# Altium schematic sheet currentW_cond.SchDoc
size A4; SheetNumber: 4; SheetTotal: 12; SPICEModelCacheJNOYGZHY: <root> / <DocumentId>JNOYGZHY</DocumentId> / </root>
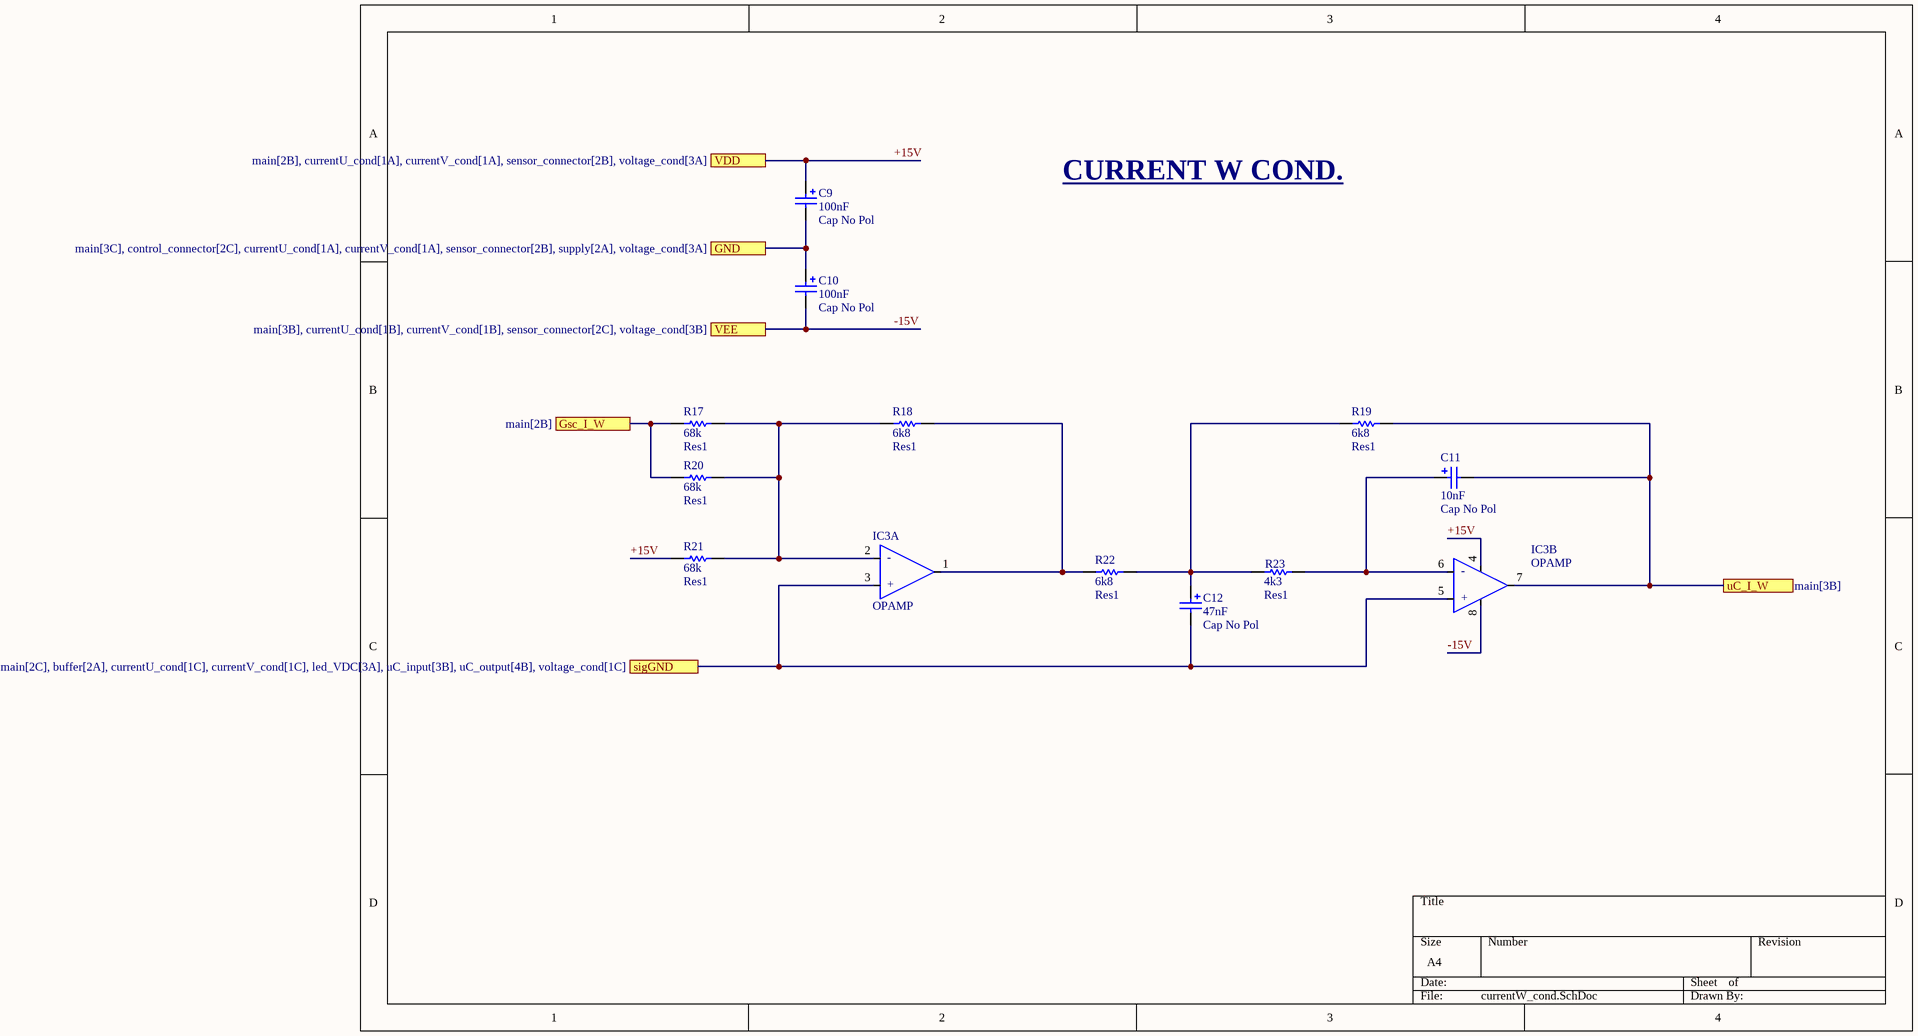
[diagram p0: currentW_cond.SchDoc]

## Parts
C9  Cap No Pol  value 100nF  [RAD-0.1_mod]
C10  Cap No Pol  value 100nF  [RAD-0.1_mod]
C11  Cap No Pol  value 10nF  [RAD-0.1_mod]
C12  Cap No Pol  value 47nF  [RAD-0.1_mod]
IC3  OPAMP  [DIP-8_mod]  (parts A,B of 2)
R17  Res1  value 68k  [AXIAL-0.3_mod]
R18  Res1  value 6k8  [AXIAL-0.3_mod]
R19  Res1  value 6k8  [AXIAL-0.3_mod]
R20  Res1  value 68k  [AXIAL-0.3_mod]
R21  Res1  value 68k  [AXIAL-0.3_mod]
R22  Res1  value 6k8  [AXIAL-0.3_mod]
R23  Res1  value 4k3  [AXIAL-0.3_mod]

## Ports
GND (see main[3C], control_connector[2C], currentU_cond[1A], currentV_cond[1A], sensor_connector[2B], supply[2A], voltage_cond[3A]), Gsc_I_W (see main[2B]), sigGND (see main[2C], buffer[2A], currentU_cond[1C], currentV_cond[1C], led_VDC[3A], uC_input[3B], uC_output[4B], voltage_cond[1C]), uC_I_W (see main[3B]), VDD (see main[2B], currentU_cond[1A], currentV_cond[1A], sensor_connector[2B], voltage_cond[3A]), VEE (see main[3B], currentU_cond[1B], currentV_cond[1B], sensor_connector[2C], voltage_cond[3B])

## Nets
+15V: C9.1 IC3.4(-V) R21.1 ; port VDD
-15V: C10.2 IC3.8(V+) ; port VEE
GND: C9.2 C10.1 ; port GND
Gsc_I_W: R17.1 R20.1 ; port Gsc_I_W
sigGND: C12.2 IC3.3(IN_A_+) IC3.5(IN_B_+) ; port sigGND
uC_I_W: C11.2 IC3.7(OUT_B) R19.2 ; port uC_I_W
NetC11_1: C11.1 IC3.6(IN_B_-) R23.2
NetC12_1: C12.1 R19.1 R22.2 R23.1
NetIC3_1: IC3.1(OUT_A) R18.2 R22.1
NetIC3_2: IC3.2(IN_A_-) R17.2 R18.1 R20.2 R21.2

## Notes on the sheet
- CURRENT W COND.
- (in symbol ADTL082, part A) -; +
- (in symbol ADTL082, part B) -; +

## Library data of the parts
C9-C12 = Cap No Pol: Polarized Capacitor (Radial); Published: 8-Jun-2000; LatestRevisionDate: 17-Jul-2002; LatestRevisionNote: Re-released for DXP Platform.; PackageReference: RB7.6-15; Publisher: Altium Limited; PackageDescription: Polarized Capacitor (Radial); 2 Leads
IC3 = ADTL082
R17-R23 = Res1: Resistor; Published: 8-Jun-2000; LatestRevisionDate: 17-Jul-2002; LatestRevisionNote: Re-released for DXP Platform.; PackageReference: AXIAL-0.3; Publisher: Altium Limited; PackageDescription: Axial Device, Thru-Hole; 2 Leads; 0.3 in Pin Spacing